# EAGLE design Shruthi-Analog-PoleMixing-v01 (EAGLE 5.09)
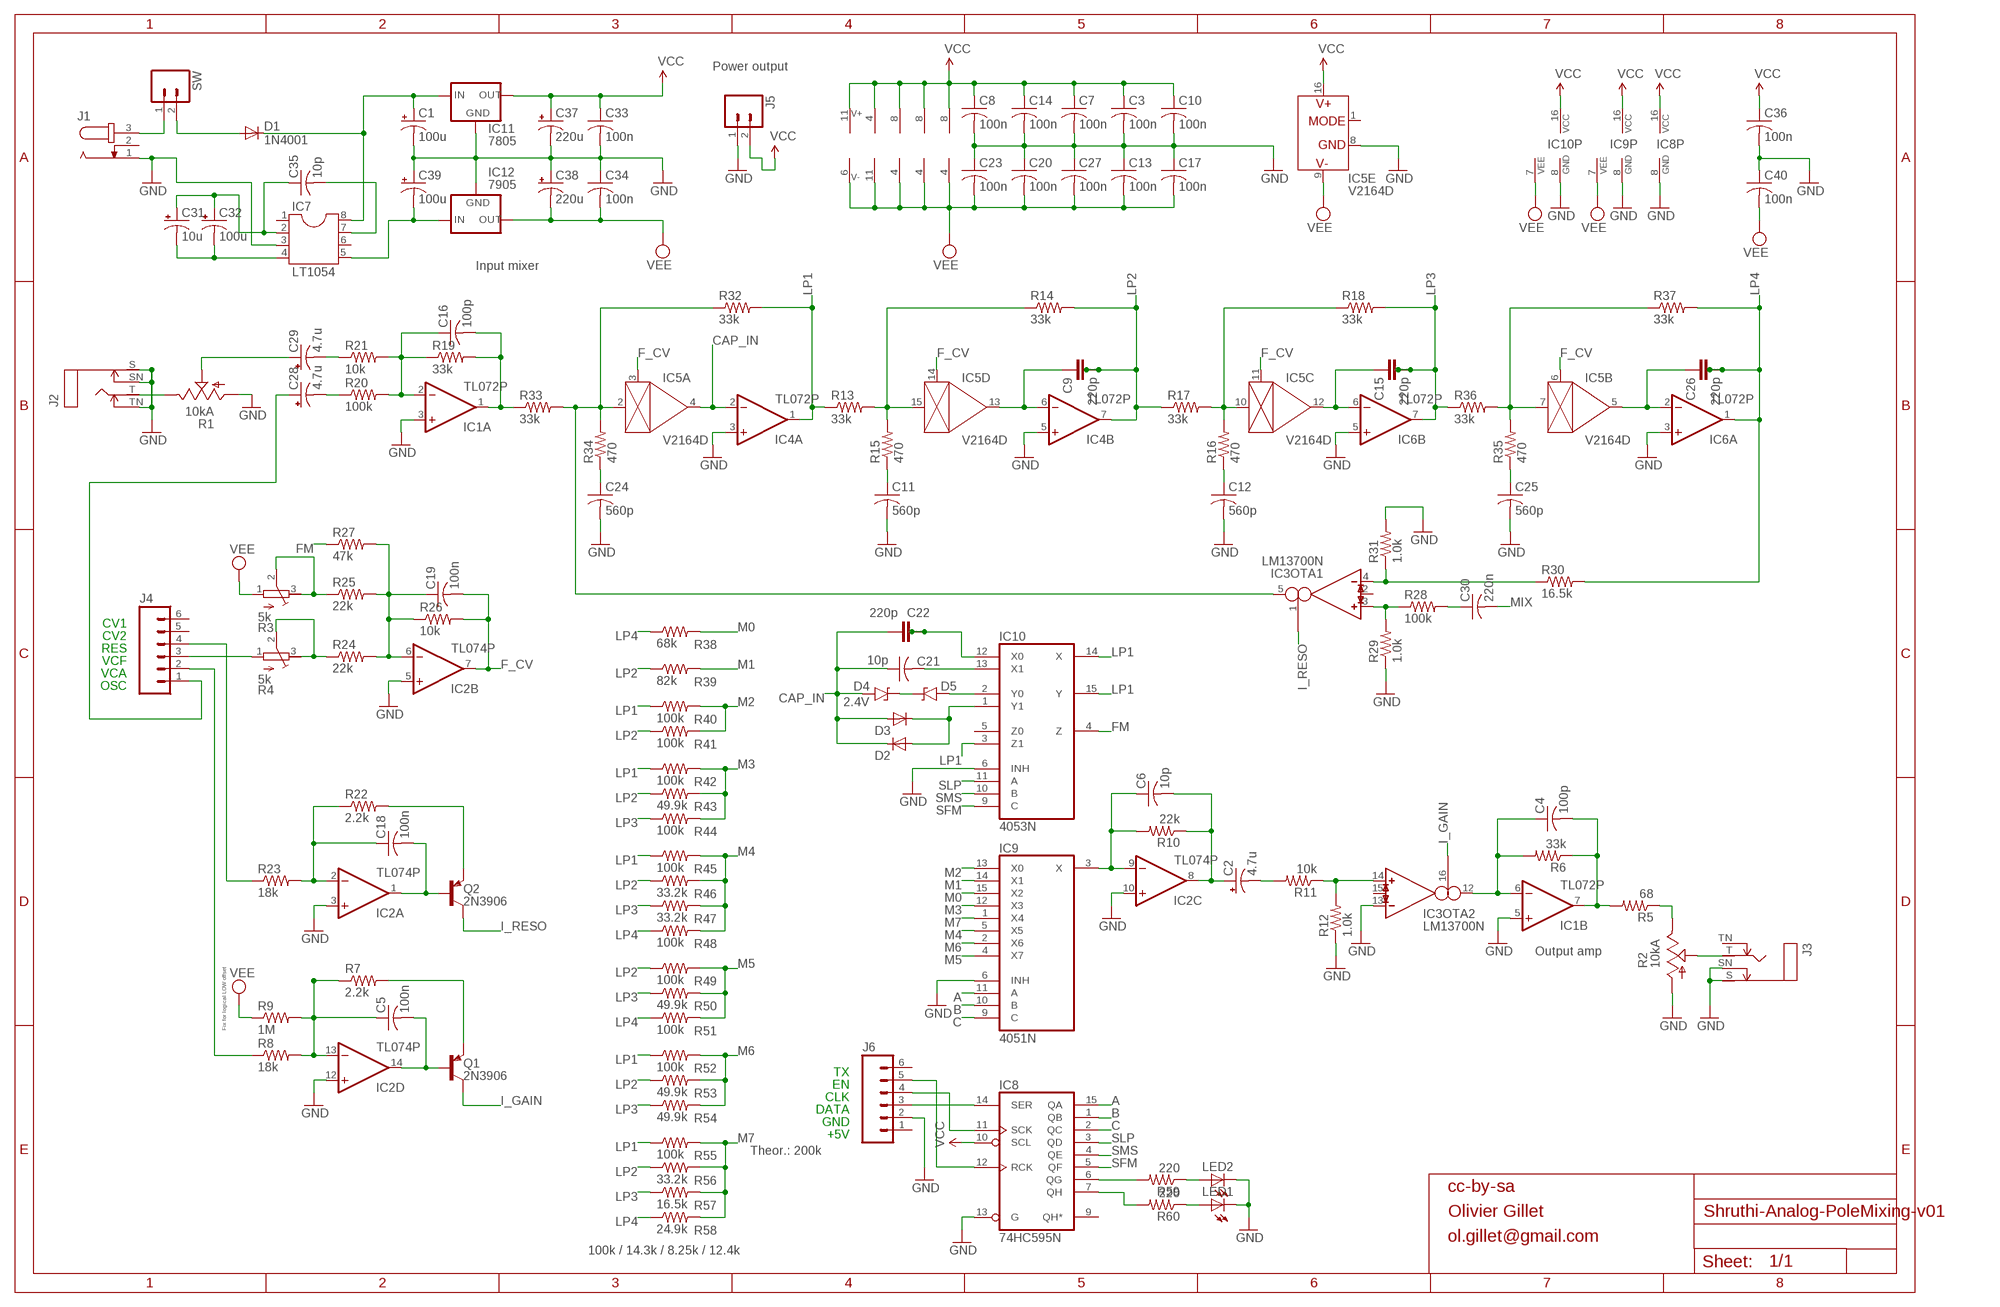
[diagram p0: schematic, sheet 1]

## Parts
C1  100u  CPOL-USE2.5-7  [E2,5-7]
C2  4.7u  CPOL-USE2.5-6  [E2,5-6]
C3  100n  C-US025-025X050  [C025-025X050]
C4  100p  C-US025-025X050  [C025-025X050]
C5  100n  C-US025-025X050  [C025-025X050]
C6  10p  C-US025-025X050  [C025-025X050]
C7  100n  C-US025-025X050  [C025-025X050]
C8  100n  C-US025-025X050  [C025-025X050]
C9  220p  C-2.5-5/4  [C2.5/5-4]
C10  100n  C-US025-025X050  [C025-025X050]
C11  560p  C-US025-025X050  [C025-025X050]
C12  560p  C-US025-025X050  [C025-025X050]
C13  100n  C-US025-025X050  [C025-025X050]
C14  100n  C-US025-025X050  [C025-025X050]
C15  220p  C-2.5-5/4  [C2.5/5-4]
C16  100p  C-US025-025X050  [C025-025X050]
C17  100n  C-US025-025X050  [C025-025X050]
C18  100n  C-US025-025X050  [C025-025X050]
C19  100n  C-US025-025X050  [C025-025X050]
C20  100n  C-US025-025X050  [C025-025X050]
C21  10p  C-US025-025X050  [C025-025X050]
C22  220p  C-2.5-5/4  [C2.5/5-4]
C23  100n  C-US025-025X050  [C025-025X050]
C24  560p  C-US025-025X050  [C025-025X050]
C25  560p  C-US025-025X050  [C025-025X050]
C26  220p  C-2.5-5/4  [C2.5/5-4]
C27  100n  C-US025-025X050  [C025-025X050]
C28  4.7u  CPOL-USE2.5-6  [E2,5-6]
C29  4.7u  CPOL-USE2.5-6  [E2,5-6]
C30  220n  C-US025-025X050  [C025-025X050]
C31  10u  CPOL-USE2.5-5  [E2,5-5]
C32  100u  CPOL-USE2.5-6  [E2,5-6]
C33  100n  C-US025-025X050  [C025-025X050]
C34  100n  C-US025-025X050  [C025-025X050]
C35  10p  C-US025-025X050  [C025-025X050]
C36  100n  C-US025-025X050  [C025-025X050]
C37  220u  CPOL-USE5-10.5  [E5-10,5]
C38  220u  CPOL-USE5-10.5  [E5-10,5]
C39  100u  CPOL-USE2.5-7  [E2,5-7]
C40  100n  C-US025-025X050  [C025-025X050]
D1  1N4001  1N4004  [DO41-10]
D2  DIODE-D-5  [D-5]
D3  DIODE-D-5  [D-5]
D4  1N47XXDO35  [D-5]
D5  1N47XXDO35  [D-5]
IC1  TL072P  [DIL08]
IC2  TL074P  [DIL14]
IC3  LM13700N  [DIL16]
IC4  TL072P  [DIL08]
IC5  V2164D  SSM2164P  [DIL16]
IC6  TL072P  [DIL08]
IC7  LT1054  DIL8  [DIL08]
IC8  74HC595N  [DIL16]
IC9  4051N  [DIL16]
IC10  4053N  [DIL16]
IC11  7805  78XXS  [78XXS]
IC12  7905  79XXS  [79XXS]
J1  JACK-PLUG2  [SPC4078_BIG_HOLES]
J2  MONOSWS  [NMJ4HC-S]
J3  MONOSWS  [NMJ4HC-S]
J4  M06SIP  [1X06]
J5  M02PTH  [1X02]
J6  M06SIP  [1X06]
LED1  LED3MM  [LED3MM]
LED2  LED3MM  [LED3MM]
Q1  2N3906  2N3906-  [TO92-]
Q2  2N3906  2N3906-  [TO92-]
R1  10kA  POT_USCABLED  [CABLE_POT_6MM]
R2  10kA  POT_USCABLED  [CABLE_POT_6MM]
R3  5k  R-TRIMM3296X  [RTRIM3296X]
R4  5k  R-TRIMM3296X  [RTRIM3296X]
R5  68  R-US_0204/7  [0204/7]
R6  33k  R-US_0204/7  [0204/7]
R7  2.2k  R-US_0204/7  [0204/7]
R8  18k  R-US_0204/7  [0204/7]
R9  1M  R-US_0204/7  [0204/7]
R10  22k  R-US_0204/7  [0204/7]
R11  10k  R-US_0204/7  [0204/7]
R12  1.0k  R-US_0204/7  [0204/7]
R13  33k  R-US_0204/7  [0204/7]
R14  33k  R-US_0204/7  [0204/7]
R15  470  R-US_0204/7  [0204/7]
R16  470  R-US_0204/7  [0204/7]
R17  33k  R-US_0204/7  [0204/7]
R18  33k  R-US_0204/7  [0204/7]
R19  33k  R-US_0204/7  [0204/7]
R20  100k  R-US_0204/7  [0204/7]
R21  10k  R-US_0204/7  [0204/7]
R22  2.2k  R-US_0204/7  [0204/7]
R23  18k  R-US_0204/7  [0204/7]
R24  22k  R-US_0204/7  [0204/7]
R25  22k  R-US_0204/7  [0204/7]
R26  10k  R-US_0204/7  [0204/7]
R27  47k  R-US_0204/7  [0204/7]
R28  100k  R-US_0204/7  [0204/7]
R29  1.0k  R-US_0204/7  [0204/7]
R30  16.5k  R-US_0204/7  [0204/7]
R31  1.0k  R-US_0204/7  [0204/7]
R32  33k  R-US_0204/7  [0204/7]
R33  33k  R-US_0204/7  [0204/7]
R34  470  R-US_0204/7  [0204/7]
R35  470  R-US_0204/7  [0204/7]
R36  33k  R-US_0204/7  [0204/7]
R37  33k  R-US_0204/7  [0204/7]
R38  68k  R-US_0204/7  [0204/7]
R39  82k  R-US_0204/7  [0204/7]
R40  100k  R-US_0204/7  [0204/7]
R41  100k  R-US_0204/7  [0204/7]
R42  100k  R-US_0204/7  [0204/7]
R43  49.9k  R-US_0204/7  [0204/7]
R44  100k  R-US_0204/7  [0204/7]
R45  100k  R-US_0204/7  [0204/7]
R46  33.2k  R-US_0204/7  [0204/7]
R47  33.2k  R-US_0204/7  [0204/7]
R48  100k  R-US_0204/7  [0204/7]
R49  100k  R-US_0204/7  [0204/7]
R50  49.9k  R-US_0204/7  [0204/7]
R51  100k  R-US_0204/7  [0204/7]
R52  100k  R-US_0204/7  [0204/7]
R53  49.9k  R-US_0204/7  [0204/7]
R54  49.9k  R-US_0204/7  [0204/7]
R55  100k  R-US_0204/7  [0204/7]
R56  33.2k  R-US_0204/7  [0204/7]
R57  16.5k  R-US_0204/7  [0204/7]
R58  24.9k  R-US_0204/7  [0204/7]
R59  220  R-US_0204/2V  [0204V]
R60  220  R-US_0204/2V  [0204V]
SW  M02PTH  [1X02]

## Nets
A: IC8.15(QA) IC9.11(A)
B: IC8.1(QB) IC9.10(B)
C: IC8.2(QC) IC9.9(C)
CAP_IN: C21.1 C22.1 D2.C D3.A D4.A IC4.2(A:-IN) IC5.4(A:OUT)
F_CV: C19.2 IC2.7(B:OUT) IC5.3(A:CTRL) IC5.6(B:CTRL) IC5.11(C:CTRL) IC5.14(D:CTRL) R26.2
FM: IC10.4(Z) R27.1
GND: C1.- C3.2 C7.2 C8.2 C10.2 C11.2 C12.2 C13.1 C14.2 C17.1 C20.1 C23.1 C24.2 C25.2 C27.1 C33.2 C34.1 C36.2 C37.- C38.+ C39.+ C40.1 IC1.3(A:+IN) IC1.5(B:+IN) IC2.3(A:+IN) IC2.5(B:+IN) IC2.10(C:+IN) IC2.12(D:+IN) IC3.13(OTA2:IN_N) IC4.3(A:+IN) IC4.5(B:+IN) IC5.8(E:GND) IC6.3(A:+IN) IC6.5(B:+IN) IC7.3 IC8.8(GND) IC8.13(G) IC9.6(INH) IC9.8(GND) IC10.6(INH) IC10.8(GND) IC11.GND IC12.GND J1.1 J2.S J2.SN J2.TN J3.S J3.SN J5.1 J6.2 LED1.K(C) LED2.K(C) R1.A R2.A R12.1 R29.1 R31.2
I_GAIN: IC3.16(OTA2:I_BIAS) Q1.1(C)
I_RESO: IC3.1(OTA1:I_BIAS) Q2.1(C)
LP1: IC4.1(A:OUT) IC10.3(Z1) IC10.14(X) IC10.15(Y) R13.1 R32.2 R40.1 R42.1 R45.1 R52.1 R55.1
LP2: C9.2 C9.3 IC4.7(B:OUT) R14.2 R17.1 R39.1 R41.1 R43.1 R46.1 R49.1 R53.1 R56.1
LP3: C15.2 C15.3 IC6.7(B:OUT) R18.2 R36.1 R44.1 R47.1 R50.1 R54.1 R57.1
LP4: C26.2 C26.3 IC6.1(A:OUT) R30.2 R37.2 R38.1 R48.1 R51.1 R58.1
M0: IC9.15(X2) R38.2
M1: IC9.14(X1) R39.2
M2: IC9.13(X0) R40.2 R41.2
M3: IC9.12(X3) R42.2 R43.2 R44.2
M4: IC9.5(X5) R45.2 R46.2 R47.2 R48.2
M5: IC9.4(X7) R49.2 R50.2 R51.2
M6: IC9.2(X6) R52.2 R53.2 R54.2
M7: IC9.1(X4) R55.2 R56.2 R57.2 R58.2
MIX: C16.2 C30.2 IC1.1(A:OUT) R19.2 R33.1
N$1: C9.1 IC4.6(B:-IN) IC5.13(D:OUT)
N$2: C15.1 IC5.12(C:OUT) IC6.6(B:-IN)
N$3: IC5.10(C:IN) R16.2 R17.2 R18.1
N$4: C12.1 R16.1
N$5: C25.1 R35.1
N$6: C16.1 IC1.2(A:-IN) R19.1 R20.2 R21.2
N$7: IC5.7(B:IN) R35.2 R36.2 R37.1
N$8: C26.1 IC5.5(B:OUT) IC6.2(A:-IN)
N$9: C18.2 IC2.1(A:OUT) Q2.2(B)
N$10: C19.1 IC2.6(B:-IN) R24.2 R25.2 R26.1 R27.2
N$11: R4.2(S) R4.3(A) R24.1
N$12: J4.3 R4.1(E)
N$13: J3.T R2.S
N$14: IC8.12(RCK) J6.5
N$16: C5.2 IC2.14(D:OUT) Q1.2(B)
N$17: IC3.14(OTA2:IN_P) R11.1 R12.2
N$18: J4.4 R23.1
N$19: C2.- R11.2
N$20: IC3.4(OTA1:IN_N) R30.1 R31.1
N$21: IC3.3(OTA1:IN_P) R28.1 R29.2
N$22: C30.1 R28.2
N$23: R3.2(S) R3.3(A) R25.1
N$24: D4.C D5.C
N$25: R2.E R5.1
N$26: C11.1 R15.1
N$27: C21.2 IC10.13(X1)
N$28: IC8.6(QG) R59.2
N$29: IC8.11(SCK) J6.4
N$30: IC8.14(SER) J6.3
N$31: C22.2 C22.3 IC10.12(X0)
N$32: IC8.7(QH) R60.2
N$33: IC3.5(OTA1:OUT) IC5.2(A:IN) R32.1 R33.2 R34.2
N$34: C6.1 IC2.9(C:-IN) IC9.3(X) R10.2
N$35: C28.+ J4.1
N$36: C2.+ C6.2 IC2.8(C:OUT) R10.1
N$38: J2.T R1.E
N$39: C28.- R20.1
N$40: C24.1 R34.1
N$41: LED2.A R59.1
N$42: LED1.A R60.1
N$43: IC5.15(D:IN) R13.2 R14.1 R15.2
N$44: J1.3 SW.1
N$45: J4.2 R8.1
N$46: C1.+ D1.C IC7.8 IC11.IN
N$47: C31.+ C32.+ C35.1 IC7.2
N$48: C31.- C32.- IC7.4
N$49: C35.2 IC7.7
N$50: D2.A D3.C IC10.1(Y1)
N$51: C5.1 IC2.13(D:-IN) R7.1 R8.2 R9.2
N$55: D5.A IC10.2(Y0)
N$57: C18.1 IC2.2(A:-IN) R22.1 R23.2
N$58: C39.- IC7.5 IC12.IN
N$59: D1.A SW.2
N$60: Q2.3(E) R22.2
N$63: C4.2 IC1.7(B:OUT) R5.2 R6.1
N$66: C29.+ R1.S
N$68: Q1.3(E) R7.2
N$70: C4.1 IC1.6(B:-IN) IC3.12(OTA2:OUT) R6.2
N$72: C29.- R21.1
SFM: IC8.5(QF) IC10.9(C)
SLP: IC8.3(QD) IC10.11(A)
SMS: IC8.4(QE) IC10.10(B)
VCC: C3.1 C7.1 C8.1 C10.1 C14.1 C33.1 C36.1 C37.+ IC1.8(P:V+) IC2.4(P:V+) IC3.11(SUPPLY:V+) IC4.8(P:V+) IC5.16(E:V+) IC6.8(P:V+) IC8.10(SCL) IC8.16(VCC) IC9.16(VCC) IC10.16(VCC) IC11.OUT J5.2
VEE: C13.2 C17.2 C20.2 C23.2 C27.2 C34.2 C38.- C40.2 IC1.4(P:V-) IC2.11(P:V-) IC3.6(SUPPLY:V-) IC4.4(P:V-) IC5.9(E:V-) IC6.4(P:V-) IC9.7(VEE) IC10.7(VEE) IC12.OUT R3.1(E) R9.1
Unconnected: IC3.2(OTA1:I_DIODE) IC3.7(BUF1:B) IC3.8(BUF1:E) IC3.9(BUF2:E) IC3.10(BUF2:B) IC3.15(OTA2:I_DIODE) IC5.1(E:MODE) IC7.1 IC7.6 IC8.9(QH*) IC10.5(Z0) J1.2 J3.TN J4.5 J4.6 J6.1 J6.6

## Notes on the sheet
- Power output
- Input mixer
- CV1
- CV2
- RES
- VCF
- VCA
- OSC
- 2.4V
- Output amp
- Fix for logical LOW offset
- TX
- EN
- CLK
- DATA
- GND
- +5V
- Theor.: 200k
- cc-by-sa
- Olivier Gillet
- ol.gillet@gmail.com
- 100k / 14.3k / 8.25k / 12.4k

## Library data of the parts
C1 C2 C28 C29 C31 C32 C37-C39 = rcl:CPOL-US: POLARIZED CAPACITOR, American symbol
C3-C8 C10-C14 C16-C21 C23-C25 C27 C30 C33-C36 C40 = rcl:C-US: CAPACITOR, American symbol
C9 C15 C22 C26 = capacitor-wima:C-: CAPACITOR for alternative placement naming: default grid - extended grid/package width
D1 = diode:1N4004: DIODE general purpose rectifier, 1 A
D2 D3 = diode:DIODE-: DIODE
D4 D5 = og-diodes:1N47XX: Zener Diode 1N4728 - 1N4764: 3.3 V - 100V, 10% (1n47xxA 5%); DO-41 glass case
IC1 = gm-ics:TL072: OP AMP
IC2 = linear:TL074: OP AMP
IC3 = ota:LM13700: Dual OTA with buffers
IC4 IC6 = linear:TL072: OP AMP
IC5 = ssm2164:SSM2164
IC7 = ic-package:DIL8: Dual In Line / Socket
IC8 = 74xx-eu:74*595: 8-bit SHIFT REGISTER, output latch
IC9 = 40xx:4051: 8-channel ANALOG MULTIPLEXER
IC10 = 40xx:4053: Triple 2-channel ANALOG MULTIPLEXER
IC11 = v-reg:78XXS: VOLTAGE REGULATOR
IC12 = v-reg:79XXS: VOLTAGE REGULATOR
J1 = con-jack2:JACK-PLUG: DC POWER JACK Power Jack, DC, Right Angle, Through Hole, Rated 5A at 16VDC, PC Terminals Distributor: Farnell (www.Farnell.de) Drawing: 84N1161.pdf / 84N1162.pdf Manufacturer: SPC Technology (www.spctechnology.com) Type: SPC4077 / SPC 4078
J2 J3 = og-neutrik:MONOSW
J4 J6 = SparkFun:M06: Header 6 Standard 6-pin 0.1" header. Use with straight break away headers (SKU : PRT-00116), right angle break away headers (PRT-00553), swiss pins (PRT-00743), machine pins (PRT-00117), and female headers (PRT-00115). Molex polarized connector foot print use with SKU : PRT-08094 with associated crimp pins and housings. NOTES ON THE VARIANTS LOCK and LOCK_LONGPADS... This footprint was designed to help hold the alignment of a through-hole component (i.e. 6-pin header) while soldering it into place. You may notice that each hole has been shifted either up or down by 0.005 of an inch from it's more standard position (which is a perfectly straight line). This slight alteration caused the pins (the squares in the middle) to touch the edges of the holes. Because they are alternating, it causes a "brace" to hold the component in place. 0.005 has proven to be the perfect amount of "off-center" position when using our standard breakaway headers. Although looks a little odd when you look at the bare footprint, once you have a header in there, the alteration is very hard to notice. Also, if you push a header all the way into place, it is covered up entirely on the bottom side. This idea of altering the position of holes to aid alignment will be further integrated into the Sparkfun Library for other footprints. It can help hold any component with 3 or more connection pins.
J5 SW = SparkFun:M02: Header 2 Standard 2-pin 0.1" header. Use with straight break away headers (SKU : PRT-00116), right angle break away headers (PRT-00553), swiss pins (PRT-00743), machine pins (PRT-00117), and female headers (PRT-00115). Molex polarized connector foot print use with SKU : PRT-08233 with associated crimp pins and housings.
LED1 LED2 = led:LED: LED OSRAM: - CHIPLED LG R971, LG N971, LY N971, LG Q971, LY Q971, LO R971, LY R971 LH N974, LH R974 LS Q976, LO Q976, LY Q976 LO Q996 - Hyper CHIPLED LW Q18S LB Q993, LB Q99A, LB R99A - SideLED LS A670, LO A670, LY A670, LG A670, LP A670 LB A673, LV A673, LT A673, LW A673 LH A674 LY A675 LS A676, LA A676, LO A676, LY A676, LW A676 LS A679, LY A679, LG A679 - Hyper Micro SIDELED® LS Y876, LA Y876, LO Y876, LY Y876 LT Y87S - SmartLED LW L88C, LW L88S LB L89C, LB L89S, LG L890 LS L89K, LO L89K, LY L89K LS L896, LA L896, LO L896, LY L896 - TOPLED LS T670, LO T670, LY T670, LG T670, LP T670 LSG T670, LSP T670, LSY T670, LOP T670, LYG T670 LG T671, LOG T671, LSG T671 LB T673, LV T673, LT T673, LW T673 LH T674 LS T676, LA T676, LO T676, LY T676, LB T676, LH T676, LSB T676, LW T676 LB T67C, LV T67C, LT T67C, LS T67K, LO T67K, LY T67K, LW E67C LS E67B, LA E67B, LO E67B, LY E67B, LB E67C, LV E67C, LT E67C LW T67C LS T679, LY T679, LG T679 LS T770, LO T770, LY T770, LG T770, LP T770 LB T773, LV T773, LT T773, LW T773 LH T774 LS E675, LA E675, LY E675, LS T675 LS T776, LA T776, LO T776, LY T776, LB T776 LHGB T686 LT T68C, LB T68C - Hyper Mini TOPLED® LB M676 - Mini TOPLED Santana® LG M470 LS M47K, LO M47K, LY M47K Source: http://www.osram.convergy.de LUXEON: - LUMILED® LXK2-PW12-R00, LXK2-PW12-S00, LXK2-PW14-U00, LXK2-PW14-V00 LXK2-PM12-R00, LXK2-PM12-S00, LXK2-PM14-U00 LXK2-PE12-Q00, LXK2-PE12-R00, LXK2-PE12-S00, LXK2-PE14-T00, LXK2-PE14-U00 LXK2-PB12-K00, LXK2-PB12-L00, LXK2-PB12-M00, LXK2-PB14-N00, LXK2-PB14-P00, LXK2-PB14-Q00 LXK2-PR12-L00, LXK2-PR12-M00, LXK2-PR14-Q00, LXK2-PR14-R00 LXK2-PD12-Q00, LXK2-PD12-R00, LXK2-PD12-S00 LXK2-PH12-R00, LXK2-PH12-S00 LXK2-PL12-P00, LXK2-PL12-Q00, LXK2-PL12-R00 Source: www.luxeon.com KINGBRIGHT: KA-3528ASYC Source: www.kingbright.com
Q1 Q2 = gm-trans:2N3906: PNP Transistor
R1 R2 = pot-alps:POT_US
R3 R4 = rcl:R-TRIMM: Trimm resistor
R5-R60 = rcl:R-US_: RESISTOR, American symbol

## Board
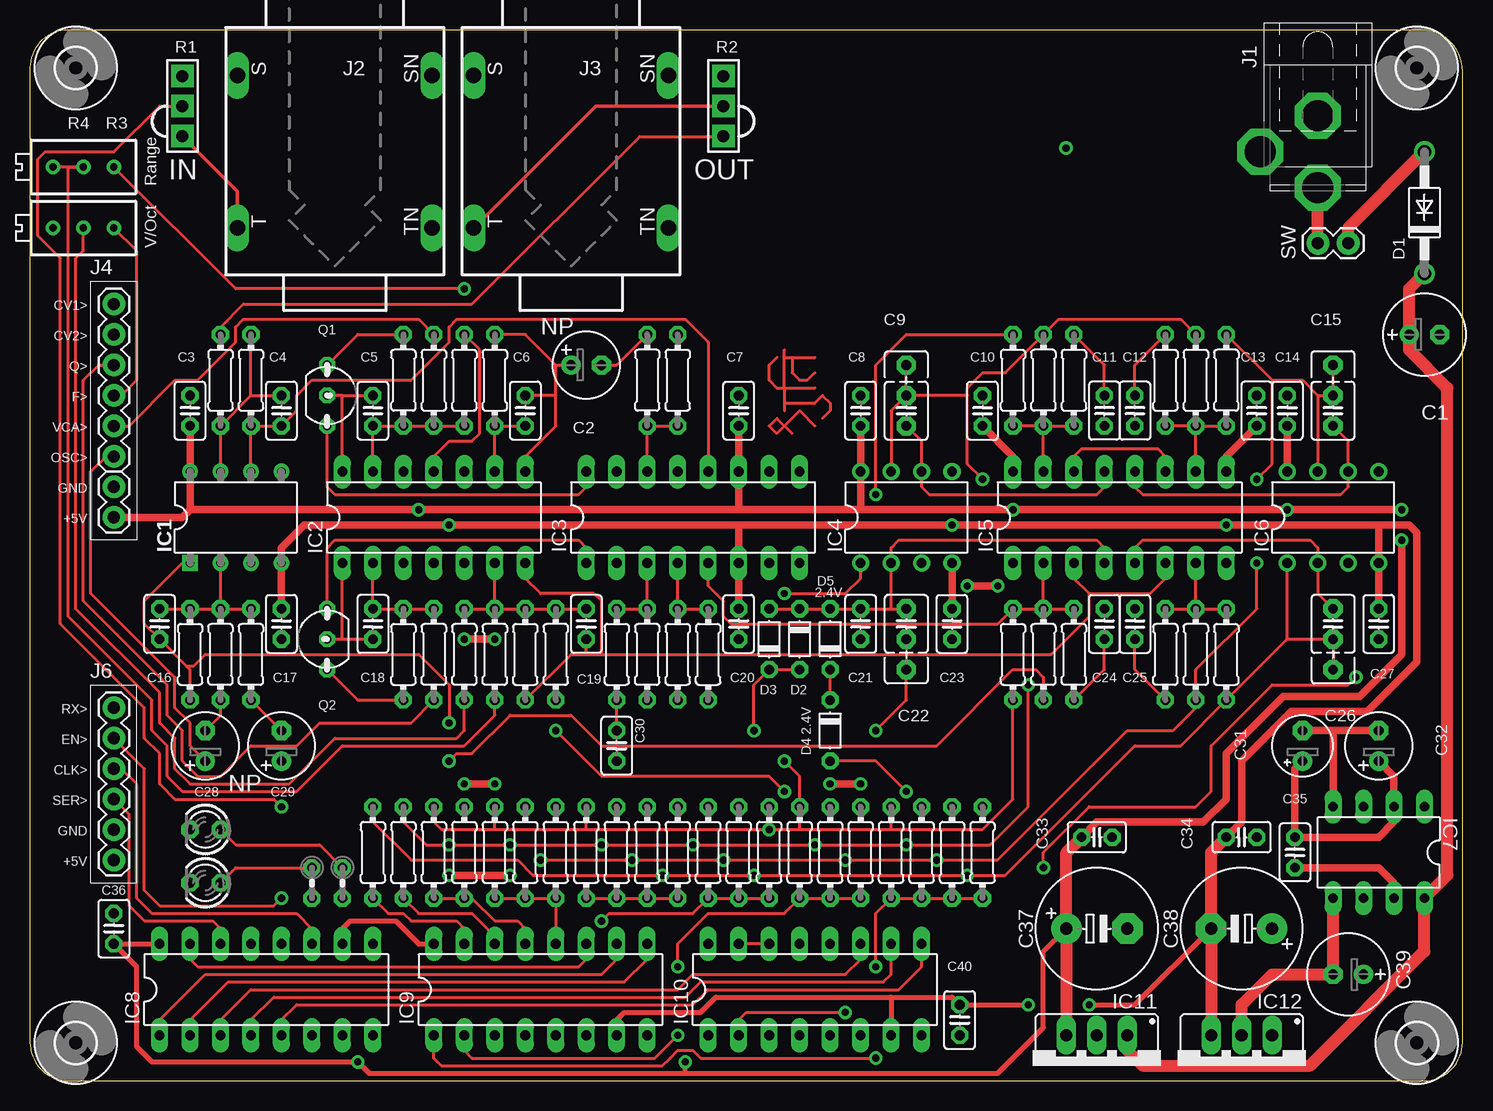
[diagram p1: board, top side]
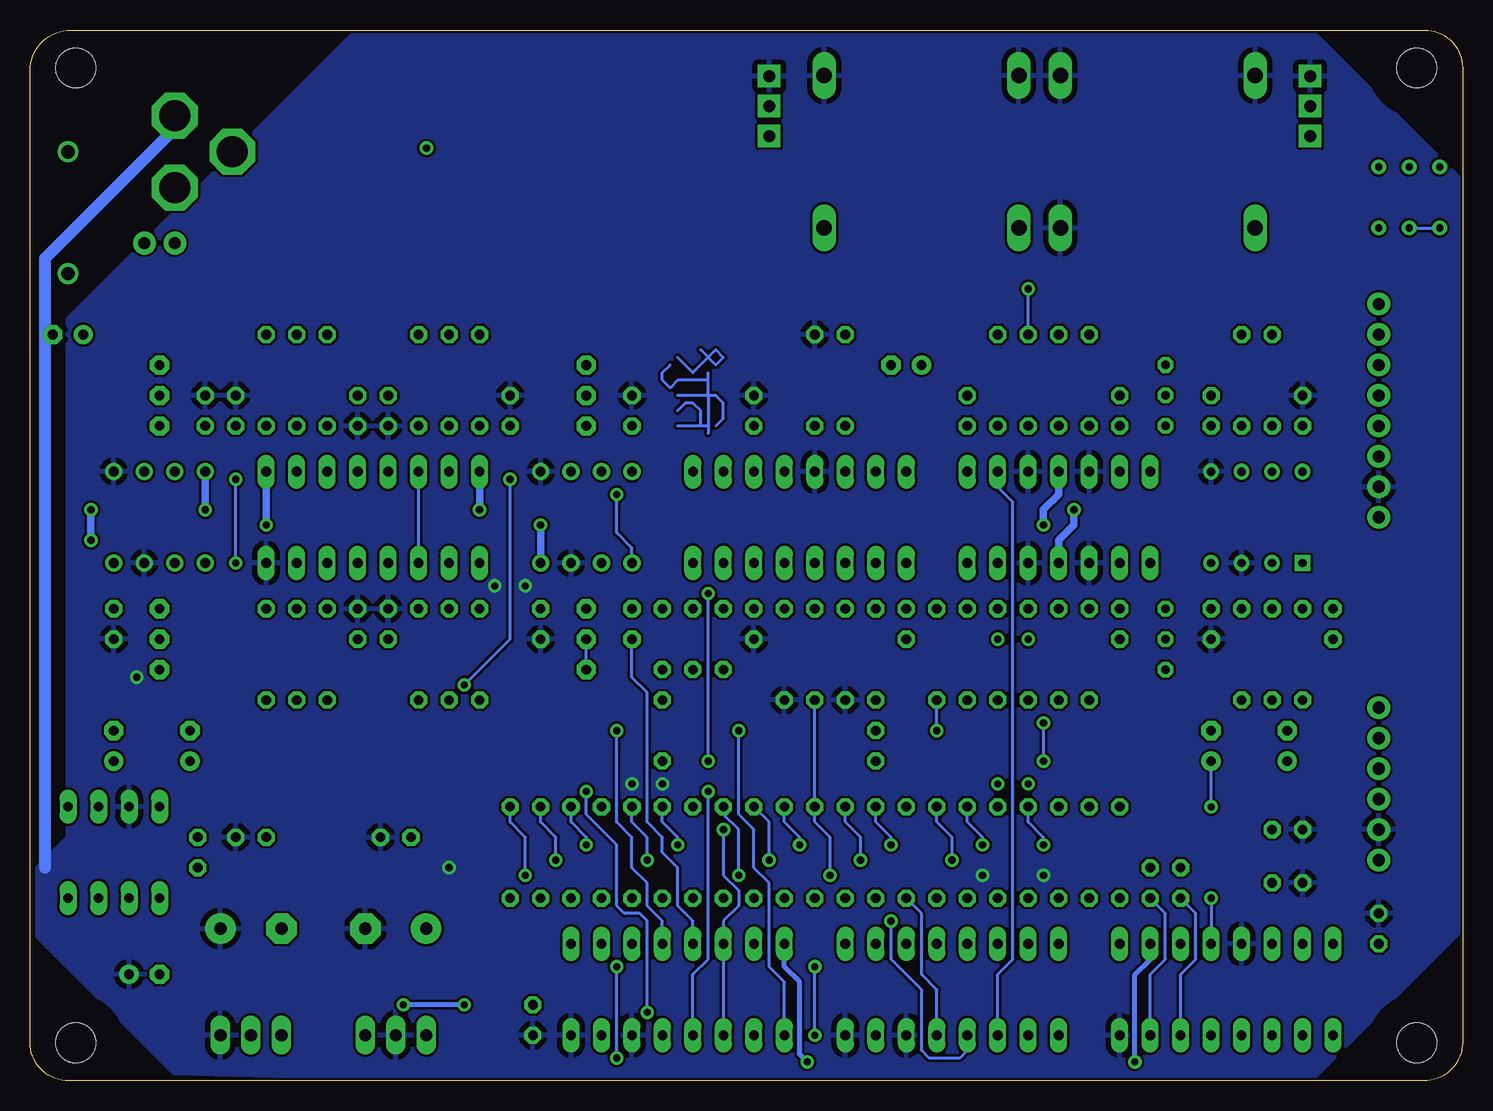
[diagram p2: board, bottom side, seen from below]

Size 119.38 x 87.62 mm. Coordinates in mm from the lower left corner, seen from the top.
Outline: 119.38,84.21 arc90 115.97,87.62 3.17,87.62 arc90 0,84.45 0,3.24 arc90 3.24,0 116.14,0 arc90 119.38,3.24 119.38,84.21
Copper layers (1*16): Top 0.035mm / dielectric 1.5mm / Bottom 0.035mm
Design rules "SparkFun_10mil *": minimum track width 8mil, minimum drill 20mil, track to track 8mil, track to pad 8mil, pad to pad 8mil, via to via 8mil, smd to smd 8mil, copper to edge 8mil, drill to drill 8mil, minimum pad ring 12mil, minimum via ring 10mil, stop-mask expansion 4mil, vias tented up to drill 25mil, thermal gap 18mil

### Footprints (pad centres in the part's own frame; a part is rotated, then mirrored left to right if it is on the bottom)
E2,5-7 = drill 0.813 pad 1.6 round: + -1.27,0 | drill 0.813 pad 1.6 octagon: - 1.27,0
E2,5-6 = drill 0.813 pad 1.6 round: + -1.27,0 | drill 0.813 pad 1.6 octagon: - 1.27,0
C025-025X050 = drill 0.813 octagon: 1 -1.27,0; 2 1.27,0
C2.5/5-4 = drill 0.813 pad 1.6 octagon: 1 -1.27,0; 2 1.27,0; 3 3.81,0
E2,5-5 = drill 0.813 pad 1.6 round: + -1.27,0 | drill 0.813 pad 1.6 octagon: - 1.27,0
E5-10,5 = drill 1.016 pad 2.54 round: + -2.54,0 | drill 1.016 pad 2.54 octagon: - 2.54,0
DO41-10 = drill 1.118 round: A 5.08,0; C -5.08,0
D-5 = drill 0.813 octagon: A 2.54,0; C -2.54,0
DIL08 = drill 0.7 square: 1 -3.81,-3.81 | drill 0.7 round: 2 -1.27,-3.81; 3 1.27,-3.81; 4 3.81,-3.81; 5 3.81,3.81; 6 1.27,3.81; 7 -1.27,3.81; 8 -3.81,3.81
DIL14 = drill 0.813 long: 1 -7.62,-3.81; 2 -5.08,-3.81; 3 -2.54,-3.81; 4 0,-3.81; 5 2.54,-3.81; 6 5.08,-3.81; 7 7.62,-3.81; 8 7.62,3.81; 9 5.08,3.81; 10 2.54,3.81; 11 0,3.81; 12 -2.54,3.81; 13 -5.08,3.81; 14 -7.62,3.81
DIL16 = drill 0.813 long: 1 -8.89,-3.81; 2 -6.35,-3.81; 3 -3.81,-3.81; 4 -1.27,-3.81; 5 1.27,-3.81; 6 3.81,-3.81; 7 6.35,-3.81; 8 8.89,-3.81; 9 8.89,3.81; 10 6.35,3.81; 11 3.81,3.81; 12 1.27,3.81; 13 -1.27,3.81; 14 -3.81,3.81; 15 -6.35,3.81; 16 -8.89,3.81
DIL08' = drill 0.813 pad 1.27 round: 1 -3.81,-3.81; 2 -1.27,-3.81; 3 1.27,-3.81; 4 3.81,-3.81; 5 3.81,3.81; 6 1.27,3.81; 7 -1.27,3.81; 8 -3.81,3.81
DIL08'' = drill 0.813 long: 1 -3.81,-3.81; 2 -1.27,-3.81; 3 1.27,-3.81; 4 3.81,-3.81; 5 3.81,3.81; 6 1.27,3.81; 7 -1.27,3.81; 8 -3.81,3.81
78XXS = drill 1.016 long: GND 0,-2.54; IN -2.54,-2.54; OUT 2.54,-2.54
79XXS = drill 1.016 long: GND -2.54,-2.54; IN 0,-2.54; OUT 2.54,-2.54
SPC4078_BIG_HOLES = drill 2.6 pad 3.81 octagon: 1 -0.46,0; 2 2.54,-4.8; 3 5.54,0
NMJ4HC-S = drill 1.3 long: S 5.08,8.115; SN 5.08,-8.115; T -7.62,8.115; TN -7.62,-8.115
1X06 = drill 1.016 pad 1.88 round: 1 0,0; 2 2.54,0; 3 5.08,0; 4 7.62,0; 5 10.16,0; 6 12.7,0
1X02 = drill 1.016 pad 1.88 round: 1 0,0; 2 2.54,0
LED3MM = drill 0.813 octagon: A -1.27,0; K 1.27,0
TO92- = drill 0.7 octagon: 1 2.54,0; 2 0,0; 3 -2.54,0
CABLE_POT_6MM = drill 1 pad 1.88 square: A -2.5,0; E 2.5,0; S 0,0
RTRIM3296X = drill 0.61 round: 1 0,-2.54; 2 0,0; 3 0,2.54
0204/7 = drill 0.813 octagon: 1 -3.81,0; 2 3.81,0
0204V = drill 0.813 octagon: 1 -1.27,0; 2 1.27,0
3,3 = hole 3.3: 0,0

### Placement (x,y rotation side)
C1  116.2,62.23 0 top
C2  46.35,59.69 0 top
C3  13.34,55.88 90 top
C4  20.96,55.88 90 top
C5  28.57,55.88 90 top
C6  41.27,55.88 90 top
C7  59.05,55.88 90 top
C8  69.22,55.88 90 top
C9  73.03,55.88 90 top
C10  79.38,55.88 90 top
C11  89.53,55.88 270 top
C12  92.08,55.88 270 top
C13  102.23,55.88 270 top
C14  104.78,55.88 90 top
C15  108.58,55.88 90 top
C16  10.79,38.1 270 top
C17  20.96,38.1 90 top
C18  28.57,38.1 270 top
C19  46.35,38.1 270 top
C20  59.05,38.1 90 top
C21  69.22,38.1 270 top
C22  73.03,38.1 270 top
C23  76.83,38.1 90 top
C24  89.53,38.1 90 top
C25  92.08,38.1 90 top
C26  108.58,38.1 270 top
C27  112.39,38.1 90 top
C28  14.61,27.94 90 top
C29  20.96,27.94 90 top
C30  48.89,27.94 270 top
C31  106.05,27.94 90 top
C32  112.39,27.94 90 top
C33  88.9,20.32 0 top
C34  100.97,20.32 180 top
C35  105.41,19.05 270 top
C36  6.99,12.7 90 top
C37  88.9,12.7 0 top
C38  100.97,12.7 180 top
C39  109.86,8.89 180 top
C40  77.47,5.08 90 top
D1  116.2,72.39 90 top
D2  64.14,36.83 270 top
D3  61.59,36.83 90 top
D4  66.67,36.83 90 top
D5  66.67,29.21 270 top
IC1  17.14,46.99 0 top
IC2  33.66,46.99 0 top
IC3  55.24,46.99 0 top
IC4  TL072P  [DIL08']  73.03,46.99 0 top
IC5  90.8,46.99 0 top
IC6  TL072P  [DIL08']  108.58,46.99 0 top
IC7  LT1054  [DIL08'']  112.39,19.05 180 top
IC8  19.68,7.62 0 top
IC9  42.55,7.62 0 top
IC10  65.41,7.62 0 top
IC11  88.9,1.27 180 top
IC12  100.97,1.27 180 top
J1  107.31,80.01 270 top
J2  25.4,78.74 90 top
J3  45.09,78.74 90 top
J4  6.99,52.07 90 top
J5  6.99,49.53 270 top
J6  6.99,18.41 90 top
LED1  14.61,20.95 180 top
LED2  14.61,16.51 180 top
Q1  24.77,57.15 270 top
Q2  24.77,36.83 90 top
R1  12.7,81.28 270 top
R2  57.78,81.28 270 top
R3  4.45,76.2 90 top
R4  4.45,71.12 90 top
R5  15.88,58.42 270 top
R6  18.41,58.42 270 top
R7  31.11,58.42 90 top
R8  33.66,58.42 270 top
R9  36.2,58.42 270 top
R10  38.73,58.42 270 top
R11  51.44,58.42 90 top
R12  53.98,58.42 270 top
R13  81.92,58.42 270 top
R14  84.45,58.42 90 top
R15  87,58.42 270 top
R16  94.61,58.42 270 top
R17  97.16,58.42 270 top
R18  99.69,58.42 90 top
R19  13.34,35.56 270 top
R20  15.88,35.56 90 top
R21  18.41,35.56 90 top
R22  31.11,35.56 270 top
R23  33.66,35.56 90 top
R24  36.2,35.56 90 top
R25  38.73,35.56 90 top
R26  41.27,35.56 270 top
R27  43.81,35.56 90 top
R28  48.89,35.56 270 top
R29  51.44,35.56 90 top
R30  53.98,35.56 270 top
R31  56.52,35.56 270 top
R32  81.92,35.56 270 top
R33  84.45,35.56 90 top
R34  87,35.56 90 top
R35  94.61,35.56 90 top
R36  97.16,35.56 90 top
R37  99.69,35.56 270 top
R38  28.57,19.05 270 top
R39  31.11,19.05 270 top
R40  33.66,19.05 270 top
R41  36.2,19.05 270 top
R42  38.73,19.05 270 top
R43  41.27,19.05 270 top
R44  43.81,19.05 270 top
R45  46.35,19.05 270 top
R46  48.89,19.05 270 top
R47  51.44,19.05 270 top
R48  53.98,19.05 270 top
R49  56.52,19.05 270 top
R50  59.05,19.05 270 top
R51  61.59,19.05 270 top
R52  64.14,19.05 270 top
R53  66.67,19.05 270 top
R54  69.22,19.05 270 top
R55  71.75,19.05 270 top
R56  74.3,19.05 270 top
R57  76.83,19.05 270 top
R58  79.38,19.05 270 top
R59  23.5,16.51 270 top
R60  26.04,16.51 270 top
SW  107.31,69.85 0 top
U$1  [3,3]  3.81,84.45 0 top
U$2  [3,3]  115.57,84.45 0 top
U$3  [4POLE_MISSION]  55.88,63.5 0 top
U$4  [3,3]  3.81,3.17 0 top
U$5  [3,3]  115.57,3.17 0 top

### Tracks (layer width: path | path; a pad name or v marks a point on that pad's centre or on a via)
A
  Top 0.254: IC9.11 46.35,10.16 45.72,9.53 13.97,9.53 13.34,10.16 IC8.15
B
  Top 0.254: IC8.1 10.79,5.08 14.61,8.89 47.62,8.89 48.89,10.16 IC9.10
C
  Top 0.254: IC8.2 13.34,5.08 16.51,8.26 49.53,8.26 51.44,10.16 IC9.9
CAP_IN
  Top 0.254: IC5.4 89.53,44.45 88.9,45.09 72.39,45.09 71.75,44.45 IC4.2 71.75,39.37 | 71.75,39.37 C22.1 | 71.75,39.37 C21.1 D4.A D2.C D3.A
F_CV
  Top 0.254: IC2.7 41.27,41.91 42.55,40.64 46.99,40.64 47.62,40.01 47.62,35.56 | 46.35,35.56 47.62,35.56 | 46.35,35.56 C19.2 | IC5.3 87,41.91 88.27,40.64 | 88.27,40.64 88.27,38.73 85.09,35.56 47.62,35.56 | R26.2 45.09,35.56 46.35,35.56 | IC5.6 94.61,41.91 93.34,40.64 88.27,40.64 | IC5.11 94.61,52.07 93.98,52.71 87.63,52.71 87,52.07 IC5.14
  Bottom 0.254: IC5.3 IC5.14
FM  (via drill 0.6)
  Top 0.254: v62.87,24.13 61.59,25.4 47.62,25.4 v43.81,29.21
  Bottom 0.254: v43.81,29.21 R27.1 | v62.87,24.13 62.87,10.16 64.14,8.89 IC10.4
GND  (via drill 0.6)
  Top 0.254: v84.45,17.78 84.45,19.05 88.27,22.86 97.16,22.86 98.42,24.13 98.42,27.94 103.5,33.02 109.86,33.02 v110.49,33.66
  Top 0.61: v66.67,24.76 v69.22,24.76 | v78.11,41.28 v80.64,41.28 | v34.93,17.14 v40.01,17.14
  Bottom 1.016: J1.1 107.31,79.38 118.11,68.58 118.11,62.23 | 118.11,17.78 118.11,62.23 | 118.11,62.23 C1.-
  pour Bottom: 0,74.92 0,12.71 12.71,0 82.55,0 107.31,0.64 118.75,12.07 118.75,17.78 116.2,20.32 116.2,63.5 92.08,87.63 12.71,87.63
GND1  (via drill 0.6)
  Top 0.61: v36.2,36.83 v38.73,36.83
GND2  (via drill 0.6)
  Top 0.61: v36.2,24.76 v38.73,24.76
I_GAIN
  Top 0.254: IC3.16 46.35,49.53 45.72,48.9 25.4,48.9 24.77,49.53 Q1.1
I_RESO
  Top 0.254: IC3.1 46.35,44.45 45.72,45.09 25.4,45.09 24.77,44.45 Q2.1
LP1  (via drill 0.6)
  Top 0.254: 38.73,20.95 34.29,20.95 33.66,21.59 R40.1 | 38.73,20.95 46.35,20.95 | 46.35,20.95 v61.59,20.95 64.14,20.95 | 64.14,20.95 71.75,20.95 | 71.75,20.95 79.38,20.95 81.92,23.49 R32.2 | 71.75,20.95 R55.1 | 64.14,20.95 R52.1 64.14,25.4 v62.87,26.67 | 38.73,20.95 R42.1 | 46.35,20.95 R45.1 | v62.87,40.64 67.95,40.64 69.22,41.91 IC4.1 | v70.48,48.9 70.48,59.69 73.03,62.23 R13.1 | IC10.14 IC10.15
  Bottom 0.254: v70.48,48.9 70.48,45.72 69.22,44.45 IC4.1 | IC10.3 IC10.14 61.59,13.34 60.33,14.61 60.33,15.88 61.59,17.14 v61.59,20.95 | v62.87,26.67 v62.87,40.64
LP2  (via drill 0.6)
  Top 0.254: R17.1 95.89,63.5 85.72,63.5 R14.2 81.28,59.05 79.38,59.05 78.11,57.79 78.11,57.15 | v83.19,33.02 83.19,22.86 80.01,19.68 v73.03,19.68 v65.41,19.68 v55.24,19.68 v47.62,19.68 v40.01,19.68 v34.93,19.68 33.02,19.68 31.11,21.59 R39.1 | v79.38,50.16 78.11,51.44 78.11,57.15 | IC4.7 71.75,55.88 C9.2 | C9.2 C9.3 | 78.11,57.15 C9.2
  Bottom 0.254: v73.03,19.68 73.03,20.32 74.3,21.59 R56.1 | R53.1 66.67,21.59 65.41,20.32 v65.41,19.68 | R43.1 41.27,21.59 40.01,20.32 v40.01,19.68 | R41.1 36.2,21.59 34.93,20.32 v34.93,19.68 | R46.1 48.89,21.59 47.62,20.32 v47.62,19.68 | R49.1 56.52,21.59 55.24,20.32 v55.24,19.68 | v83.19,33.02 79.38,36.83 v79.38,50.16
LP3  (via drill 0.6)
  Top 0.254: v102.23,43.18 102.23,39.37 97.16,34.29 R36.1 97.16,31.11 95.25,29.21 91.44,29.21 80.64,18.41 v75.56,18.41 v67.95,18.41 v57.78,18.41 v50.16,18.41 v42.55,18.41 | v102.23,50.16 103.5,51.44 103.5,58.42 | 103.5,58.42 R18.2 | C15.3 C15.2 107.31,57.15 | 103.5,58.42 106.05,58.42 107.31,57.15 | 107.31,57.15 IC6.7
  Bottom 0.254: v102.23,43.18 v102.23,50.16 | v75.56,18.41 75.56,20.32 76.83,21.59 R57.1 | R54.1 69.22,21.59 67.95,20.32 v67.95,18.41 | R50.1 57.78,21.59 v57.78,18.41 | R47.1 51.44,21.59 50.16,20.32 v50.16,18.41 | R44.1 43.81,21.59 42.55,20.32 v42.55,18.41
LP4  (via drill 0.6)
  Top 0.254: R38.1 28.57,21.59 31.75,18.41 40.64,18.41 41.91,17.14 v52.7,17.14 v60.33,17.14 v78.11,17.14 81.28,17.14 92.08,27.94 95.89,27.94 R37.2 104.78,36.83 | C26.3 C26.2 104.78,36.83 | 104.78,36.83 IC6.1
  Bottom 0.254: v78.11,17.14 78.11,20.32 79.38,21.59 R58.1 | R51.1 61.59,22.22 60.33,20.95 v60.33,17.14 | v52.7,17.14 52.7,20.32 53.98,21.59 R48.1 R30.2
M0
  Top 0.254: IC9.15 36.2,12.7 35.56,13.34 31.75,13.34 31.11,13.97 29.84,13.97 R38.2
M1
  Top 0.254: R39.2 32.38,13.97 36.83,13.97 38.73,12.07 IC9.14
M2
  Top 0.254: R40.2 R41.2 36.83,15.24 38.73,13.34 40.64,13.34 41.27,12.7 IC9.13
M3
  Top 0.254: R42.2 R43.2 R44.2 IC9.12
M4
  Top 0.254: R45.2 R46.2 R47.2 R48.2
  Bottom 0.254: R45.2 45.09,13.97 45.09,8.89 43.81,7.62 IC9.5
M5  (via drill 0.6)
  Top 0.254: R51.2 R50.2 R49.2 55.24,13.97 48.26,13.97 v47.62,13.34
  Bottom 0.254: v47.62,13.34 47.62,10.16 45.09,7.62 45.09,2.54 44.45,1.91 41.91,1.91 41.27,2.54 IC9.4
M6  (via drill 0.6)
  Top 0.254: R54.2 R53.2 R52.2 62.87,13.97 56.52,13.97 53.98,11.43 v53.98,9.53 | v53.98,3.81 52.07,1.91 36.83,1.91 36.2,2.54 IC9.2
  Bottom 0.254: v53.98,3.81 v53.98,9.53
M7  (via drill 0.6)
  Top 0.254: R58.2 R57.2 R56.2 R55.2 70.48,13.97 v70.48,9.53 | v70.48,1.91 55.88,1.91 55.24,2.54 53.98,2.54 53.34,1.91 52.7,1.27 34.29,1.27 33.66,1.91 IC9.1
  Bottom 0.254: v70.48,1.91 v70.48,9.53
MIX  (via drill 0.6)
  Top 0.254: IC1.1 12.7,43.18 9.53,40.01 9.53,38.1 C16.2 13.02,34.61 | 13.02,34.61 13.34,34.29 R19.2 | v34.93,29.84 34.93,33.02 32.38,35.56 14.61,35.56 13.65,34.61 13.02,34.61 | v34.93,26.67 35.56,27.3 36.83,27.3 40.01,30.48 45.09,30.48 47.62,27.94 48.89,27.94 | 48.89,27.94 C30.2 | 48.89,27.94 75.56,27.94 81.92,34.29 83.82,34.29 84.45,33.66 R33.1
  Bottom 0.254: v34.93,29.84 v34.93,26.67
N$1
  Top 0.254: IC5.13 89.53,49.53 88.9,48.9 74.93,48.9 74.3,49.53 IC4.6 74.3,53.34 C9.1
N$2
  Top 0.254: IC5.12 92.08,49.53 92.71,48.9 109.22,48.9 109.86,49.53 IC6.6 109.86,53.34 C15.1
N$3
  Top 0.254: IC5.10 R17.2 | R17.2 R18.1 | R17.2 R16.2
N$4
  Top 0.254: C12.1 92.08,59.69 R16.1
N$5
  Top 0.254: C25.1 92.08,34.29 R35.1
N$6
  Top 0.254: C16.1 R19.1 R20.2 | R20.2 R21.2 | R20.2 IC1.2
N$7
  Top 0.254: R36.2 IC5.7 | R36.2 R37.1 | R35.2 R36.2
N$8
  Top 0.254: IC5.5 92.08,44.45 92.71,45.09 106.68,45.09 107.31,44.45 IC6.2 107.31,40.64 C26.1
N$9
  Top 0.254: 26.04,36.83 IC2.1 | Q2.2 26.04,36.83 | 26.04,36.83 C18.2
N$10
  Top 0.254: R24.2 R25.2 | R25.2 R26.1 R27.2 C19.1 | R25.2 IC2.6
N$11
  Top 0.254: R4.2 4.45,69.22 3.81,68.58 3.81,39.37 10.79,32.38 10.79,29.84 12.07,28.57 12.07,26.04 13.34,24.76 21.59,24.76 25.4,28.57 35.56,28.57 36.2,29.21 R24.1
  Bottom 0.254: R4.2 R4.3
N$12
  Top 0.254: J4.3 7.62,57.15 8.89,58.42 8.89,69.22 R4.1
N$13
  Top 0.305: J3.T 47.13,81.28 R2.S
N$14  (via drill 0.6)
  Top 0.254: J6.5 9.53,26.04 9.53,15.88 10.79,14.61 20.32,14.61 v20.96,15.24
  Bottom 0.254: v20.96,15.24 IC8.12
N$15
  Bottom 0.254: 65.41,60.33 64.14,59.05 62.23,60.96 61.59,60.33 62.23,59.69 63.5,60.96
N$16
  Top 0.254: 26.04,57.15 Q1.2 | 26.04,57.15 C5.2 | IC2.14 26.04,57.15
N$17
  Top 0.254: R12.2 R11.1 IC3.14
N$18
  Top 0.254: J4.4 5.71,59.69 4.45,58.42 4.45,40.01 11.43,33.02 11.43,30.48 12.7,29.21 12.7,26.67 13.97,25.4 15.88,25.4 18.41,27.94 22.23,27.94 24.13,29.84 31.75,29.84 R23.1
N$19
  Top 0.254: C2.- 48.89,59.69 R11.2
N$20
  Top 0.254: R31.1 R30.1 IC3.4
N$21
  Top 0.254: R28.1 R29.2 IC3.3
N$22
  Top 0.254: C30.1 R28.2
N$23
  Top 0.254: R25.1 38.73,30.48 36.2,27.94 26.04,27.94 22.23,24.13 12.7,24.13 11.43,25.4 11.43,27.94 10.16,29.21 10.16,31.75 3.18,38.73 3.18,76.2 R3.2 R3.3
N$24
  Top 0.254: D5.C D4.C
N$25
  Top 0.254: R5.1 15.88,62.87 17.78,64.77 36.83,64.77 50.8,78.74 57.78,78.74 R2.E
N$26
  Top 0.254: C11.1 89.53,59.69 R15.1
N$27
  Bottom 0.254: IC10.13 64.14,13.34 65.41,14.61 65.41,17.78 66.67,19.05 66.67,20.32 67.95,21.59 67.95,32.38 69.22,33.66 C21.2
N$28
  Bottom 0.254: R59.2 22.23,13.97 22.23,10.16 23.5,8.89 IC8.6
N$29
  Top 0.254: J6.4 7.62,26.04 8.89,24.76 8.89,15.24 10.16,13.97 22.23,13.97 23.5,12.7 IC8.11
N$30
  Top 0.254: J6.3 8.26,22.22 8.26,14.61 9.53,13.34 15.24,13.34 15.88,12.7 IC8.14
N$31  (via drill 0.6)
  Top 0.254: v70.48,29.21 73.03,31.75 C22.3
  Bottom 0.254: IC10.12 66.67,13.34 67.95,14.61 67.95,16.51 69.22,17.78 69.22,20.32 70.48,21.59 v70.48,29.21 | C22.3 C22.2
N$32
  Bottom 0.254: R60.2 24.77,13.97 24.77,10.16 26.04,8.89 IC8.7
N$33
  Top 0.254: IC3.5 56.52,41.28 57.78,40.01 57.78,38.73 58.42,38.1 80.64,38.1 R32.1 R33.2 | R33.2 R34.2 | R33.2 IC5.2
N$34
  Top 0.254: C6.1 R10.2 IC2.9
  Bottom 0.254: IC9.3 38.73,8.89 37.47,10.16 37.47,48.26 38.73,49.53 IC2.9
N$35
  Top 0.254: C28.+ 13.34,27.94 13.34,29.84 12.07,31.11 12.07,33.66 5.08,40.64 5.08,50.8 6.35,52.07 J4.1
N$36
  Top 0.254: R10.1 41.27,62.23 43.81,59.69 | IC2.8 41.27,52.07 43.81,54.61 43.81,57.15 | 43.81,57.15 43.81,59.69 | 43.81,59.69 C2.+ | 43.81,57.15 C6.2
N$37  (via drill 0.6)
  other vias: 86.33,77.77
N$38
  Top 0.305: R1.E 17.29,74.2 J2.T
N$39
  Top 0.254: C28.- 15.88,30.48 R20.1
N$40
  Top 0.254: R34.1 89.53,34.29 C24.1
N$41
  Top 0.254: LED2.A 17.14,17.78 R59.1
N$42
  Top 0.254: LED1.A 17.14,19.68 24.13,19.68 R60.1
N$43
  Top 0.254: R14.1 R13.2 | R14.1 R15.2 | IC5.15 R14.1
N$44
  Top 1.016: SW.1 J1.3
N$45
  Top 0.254: R8.1 32.38,63.5 17.78,63.5 17.14,62.87 17.14,61.59 13.97,58.42 12.07,58.42 8.26,54.61 J4.2
N$46
  Top 1.016: D1.C 114.94,66.04 C1.+ 114.94,60.96 118.11,57.79 118.11,17.14 IC7.8 116.2,10.79 106.68,1.27 92.71,1.27 91.44,2.54 IC11.IN
N$47
  Top 0.61: C31.+ 105.41,26.04 C35.1 112.39,20.32 113.67,21.59 IC7.2 113.67,25.4 C32.+
N$48
  Top 0.61: 108.58,29.21 C31.- | 108.58,29.21 C32.- | IC7.4 108.58,29.21
N$49
  Top 0.61: IC7.7 113.67,16.51 112.39,17.78 C35.2
N$50  (via drill 0.6)
  Top 0.254: v60.33,29.21 60.33,33.02 D3.C D2.A
  Bottom 0.254: IC10.1 56.52,8.26 57.78,9.53 57.78,16.51 59.05,17.78 59.05,20.95 60.33,22.22 v60.33,29.21
N$51
  Top 0.254: IC2.13 C5.1 R7.1 R8.2 R9.2
N$52
  Bottom 0.254: 62.87,58.42 62.87,59.05 | 62.87,57.15 62.87,58.42 | 62.87,57.15 62.87,54.61 | 62.87,54.61 62.87,53.98 | 63.5,54.61 65.41,54.61 | 62.87,54.61 63.5,54.61 | 63.5,54.61 63.5,55.88 64.14,56.52 64.77,56.52 65.41,55.88 | 62.87,58.42 65.41,58.42 66.04,57.79 66.67,58.42 66.67,59.05 66.04,59.69 | 62.87,57.15 65.41,57.15 | 62.87,57.15 62.23,57.15 61.59,56.52 61.59,55.25 62.23,54.61
N$53
  Top 0.254: 65.41,54.61 64.14,55.88 62.23,53.98 61.59,54.61 62.23,55.25 63.5,53.98
N$54
  Top 0.254: 62.87,56.52 62.87,55.88 | 62.87,57.79 62.87,56.52 | 62.87,57.79 62.87,60.33 | 62.87,60.33 62.87,60.96 | 63.5,60.33 65.41,60.33 | 62.87,60.33 63.5,60.33 | 63.5,60.33 63.5,59.05 64.14,58.42 64.77,58.42 65.41,59.05 | 62.87,56.52 65.41,56.52 66.04,57.15 66.67,56.52 66.67,55.88 66.04,55.25 | 62.87,57.79 65.41,57.79 | 62.87,57.79 62.23,57.79 61.59,58.42 61.59,59.69 62.23,60.33
N$55  (via drill 0.6)
  Top 0.254: v73.03,24.13 70.48,26.67 D5.A | IC10.2 59.05,5.08 59.69,5.71 v67.95,5.71
  Bottom 0.254: v73.03,24.13 73.03,22.22 70.48,19.68 70.48,14.61 69.85,13.97 68.58,13.97 67.95,13.34 v67.95,5.71
N$57
  Top 0.254: IC2.2 C18.1 R22.1 R23.2
N$58
  Top 1.016: IC7.5 C39.- 103.5,8.89 100.97,6.35 IC12.IN
N$59
  Top 1.016: SW.2 109.86,71.12 D1.A
N$60
  Top 0.254: Q2.3 27.3,31.75 R22.2
N$63
  Top 0.254: IC1.7 R5.2 18.41,57.15 | 18.41,57.15 R6.1 | 18.41,57.15 C4.2
N$66  (via drill 0.6)
  Top 0.254: v20.96,22.86 20.32,23.49 12.07,23.49 10.79,24.76 10.79,27.3 9.53,28.57 9.53,31.11 2.54,38.1 2.54,68.58 0.64,70.48 0.64,76.84 1.27,77.47 6.99,77.47 10.79,81.28 R1.S
  Bottom 0.254: v20.96,22.86 C29.+
N$68
  Top 0.254: Q1.3 27.3,62.23 R7.2
N$70
  Top 0.254: IC1.6 R6.2 C4.1 22.23,55.88 22.23,57.15 23.5,58.42 31.75,58.42 34.93,61.59 34.93,62.87 35.56,63.5 54.61,63.5 56.52,61.59 IC3.12
  Top 0.305: IC1.6 18.41,50.16
N$72
  Top 0.254: C29.- R21.1
SFM
  Top 0.254: IC8.5 20.96,5.08 22.23,6.35 55.24,6.35 56.52,7.62 72.39,7.62 74.3,9.53 IC10.9
SLP
  Top 0.254: IC8.3 15.88,5.08 18.41,7.62 53.98,7.62 55.24,8.89 67.95,8.89 69.22,10.16 IC10.11
SMS
  Top 0.254: IC8.4 18.41,5.08 20.32,6.98 54.61,6.98 55.88,8.26 71.12,8.26 71.75,8.89 IC10.10
VCC  (via drill 0.6)
  Top 0.406: IC8.16 C36.1 8.89,9.53 8.89,2.86 10.16,1.59 v27.3,1.59 28.26,0.64 54.61,0.64 | C37.+ 84.45,10.79 84.45,4.45 80.64,0.64 54.61,0.64 | IC9.16 32.38,11.43 30.48,13.34 26.67,13.34 26.04,12.7 IC8.10 | 54.61,0.64 v54.61,1.59
  Top 0.61: C33.1 88.9,21.59 97.79,21.59 99.69,23.49 99.69,27.3 104.46,32.07 110.81,32.07 114.3,35.56 v114.3,45.09 | 69.22,47.62 v81.92,47.62 v104.78,47.62 v114.3,47.62 | 69.22,47.62 59.05,47.62 | 59.05,47.62 v32.38,47.62 13.34,47.62 | IC5.16 81.92,52.07 C10.1 | 13.34,47.62 12.7,46.99 J5.2 | C3.1 IC1.8 13.34,47.62 | C8.1 IC4.8 69.22,47.62 | IC6.8 C14.1 | C7.1 IC3.11 59.05,47.62
  Top 1.016: IC11.OUT C37.+ 86.36,19.05 C33.1
  Bottom 0.406: IC8.10 26.04,10.16 27.3,8.89 v27.3,1.59 | IC10.16 56.52,9.53 55.24,8.26 55.24,2.22 v54.61,1.59
  Bottom 0.61: v114.3,45.09 v114.3,47.62 | v81.92,47.62 IC5.16 | v32.38,47.62 32.38,46.36 33.66,45.09 IC2.4 | v104.78,47.62 IC6.8
VEE  (via drill 0.6)
  Top 0.254: v36.2,66.04 17.14,66.04 R3.1 | IC2.11 33.66,52.07 34.93,53.34 36.83,53.34 37.47,53.98 37.47,60.96 R9.1
  Top 0.406: C38.- 92.08,6.35 v88.27,6.35 | v83.19,6.35 C40.2 76.83,6.98 71.75,6.98 | IC9.7 48.89,5.08 49.53,5.71 55.88,5.71 57.15,6.98 71.75,6.98 | 71.75,6.98 IC10.7
  Top 0.61: C34.2 100.97,21.59 100.97,26.67 105.09,30.8 111.44,30.8 115.57,34.92 115.57,45.72 114.94,46.36 112.39,46.36 | 59.05,46.36 v76.83,46.36 v99.69,46.36 112.39,46.36 | 59.05,46.36 v34.93,46.36 22.86,46.36 20.96,44.45 IC1.4 C17.2 | IC5.9 99.69,52.07 C13.2 | C27.2 IC6.4 112.39,46.36 | 59.05,46.36 IC3.6 C20.2 | IC4.4 C23.2
  Top 1.016: C34.2 98.42,19.05 C38.- IC12.OUT
  Bottom 0.254: R9.1 v36.2,66.04
  Bottom 0.406: v83.19,6.35 v88.27,6.35
  Bottom 0.61: v99.69,46.36 IC5.9 | v34.93,46.36 34.93,47.62 33.66,48.9 IC2.11 | v76.83,46.36 IC4.4

### Text on the board
tPlace: CV1> | CV2> | Q> | F> | VCA> | OSC> | GND | +5V | RX> | EN> | CLK> | SER> | GND | +5V
tNames: Range | IN | OUT | V/Oct | NP | 2.4V | 2.4V | NP